# EAGLE design PALM (EAGLE 9.6.2)
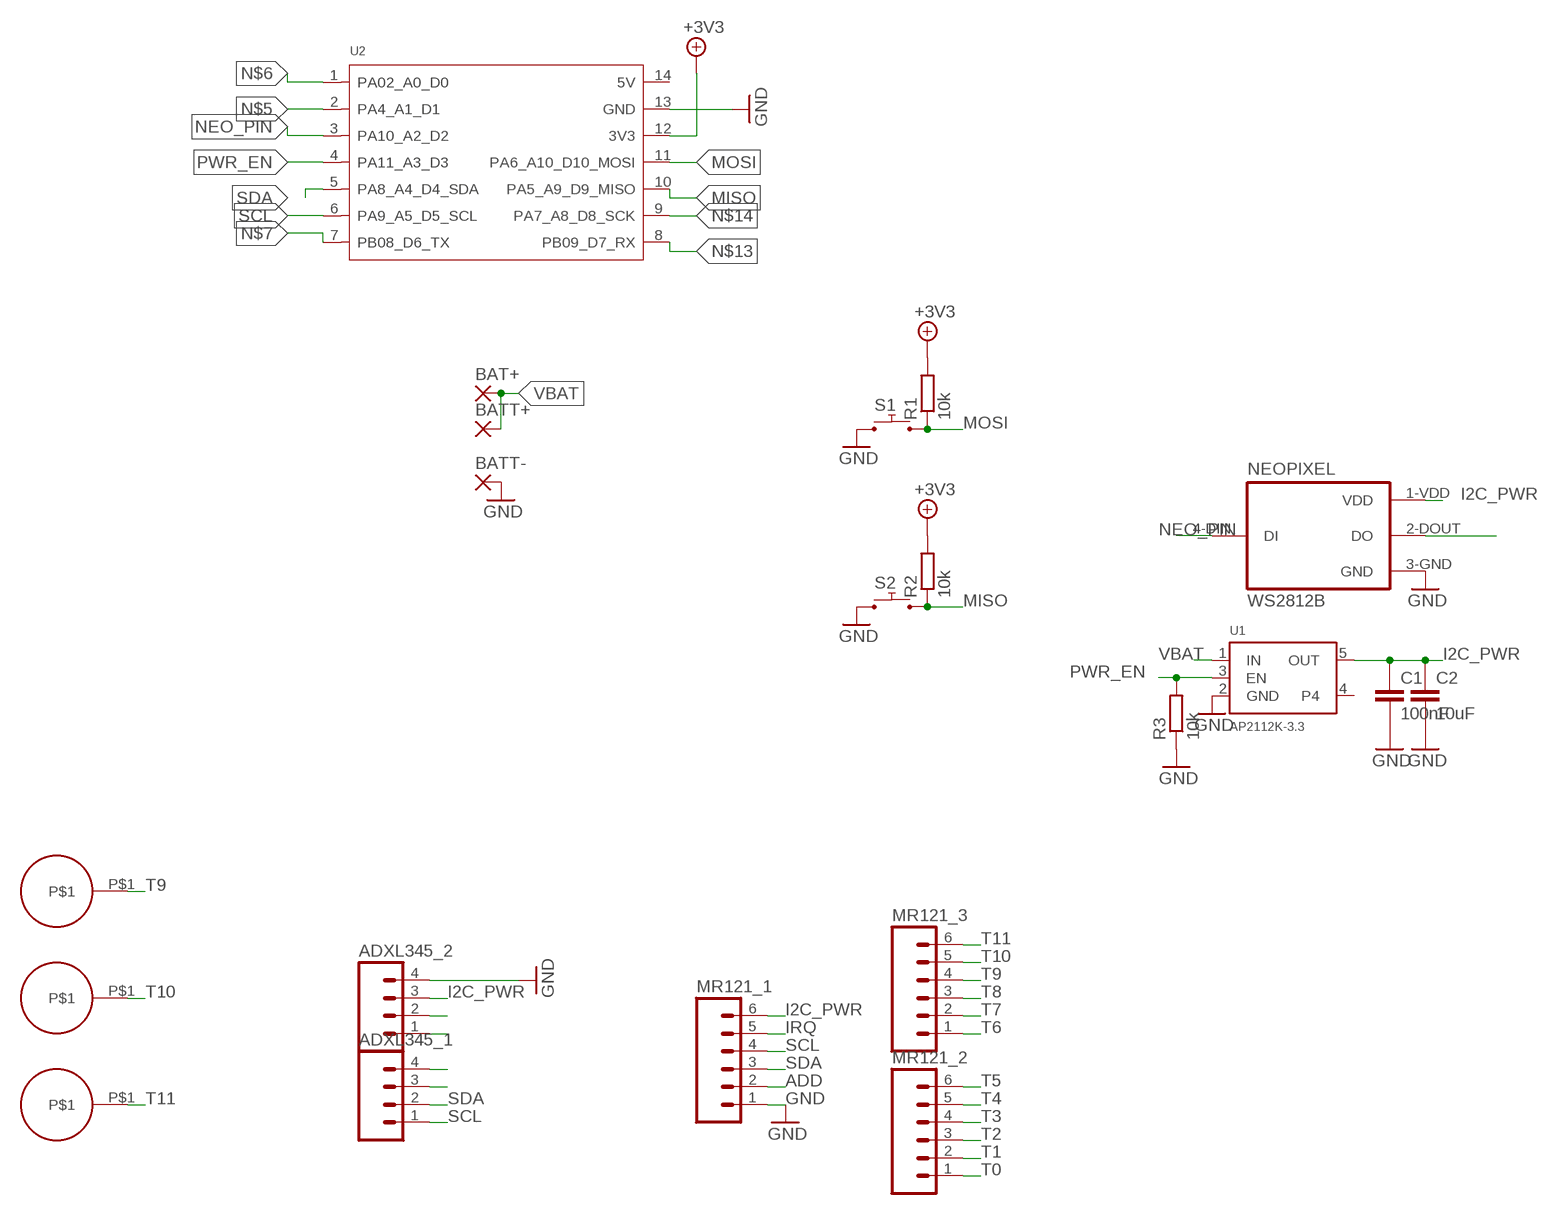
[diagram p0: schematic, sheet 1]

## Parts
ADXL345_1  M04SMD_STRAIGHT_COMBO  [1X04_SMD_STRAIGHT_COMBO]
ADXL345_2  M04SMD_STRAIGHT_COMBO  [1X04_SMD_STRAIGHT_COMBO]
BAT+  SMD2  [SMD1,27-2,54]
BATT+  SMD2  [SMD1,27-2,54]
BATT-  SMD2  [SMD1,27-2,54]
C1  100nF  CAPACITOR0805  [CAPACITOR0805]
C2  10uF  CAPACITOR0805  [CAPACITOR0805]
H2  FEROS_HEATHOLE  [FEROS_HEATHOLE3.2]
H3  FEROS_HEATHOLE  [FEROS_HEATHOLE3.2]
H4  FEROS_HEATHOLE  [FEROS_HEATHOLE3.2]
MR121_1  M06SMD-STRAIGHT-COMBO  [1X06_SMD_STRAIGHT_COMBO]
MR121_2  M06SMD-STRAIGHT-COMBO  [1X06_SMD_STRAIGHT_COMBO]
MR121_3  M06SMD-STRAIGHT-COMBO  [1X06_SMD_STRAIGHT_COMBO]
NEOPIXEL  WS2812B  [WS2812B]
R1  10k  RESISTOR0805  [0805]
R2  10k  RESISTOR0805  [0805]
R3  10k  RESISTOR0805  [0805]
S1  PUSH_MOMENTARY_THT_6X6MM  [TACTILE-PTH]
S2  PUSH_MOMENTARY_THT_6X6MM  [TACTILE-PTH]
U1  AP2112K-3.3  MICROBUILDER_VREG_SOT23-5  [MICROBUILDER_SOT23-5]
U2  MOUDLE-SEEEDUINO-XIAO-ESP32S3-SMD  [MOUDLE14P-SMD-2.54-21X17.8MM]

## Nets
+5V: R1.2 R2.2 U2.12(3V3) ; supply symbol labelled +3V3
ADD: MR121_1.2
GND: ADXL345_2.4 BATT-.1(P) C1.2 C2.2 MR121_1.1 NEOPIXEL.3-GND(GND) R3.1 S1.1 S1.2 S2.1 S2.2 U1.2(GND) U2.13(GND)
I2C_PWR: ADXL345_2.3 C1.1 C2.1 MR121_1.6 NEOPIXEL.1-VDD(VDD) U1.5(OUT)
IRQ: MR121_1.5
MISO: R2.1 S2.3 S2.4 U2.10(PA5_A9_D9_MISO)
MOSI: R1.1 S1.3 S1.4 U2.11(PA6_A10_D10_MOSI)
N$5: U2.2(PA4_A1_D1)
N$6: U2.1(PA02_A0_D0)
N$7: U2.7(PB08_D6_TX)
N$8: ADXL345_1.3
N$9: ADXL345_1.4
N$10: ADXL345_2.1
N$11: ADXL345_2.2
N$12: NEOPIXEL.2-DOUT(DO)
N$13: U2.8(PB09_D7_RX)
N$14: U2.9(PA7_A8_D8_SCK)
NEO_PIN: NEOPIXEL.4-DIN(DI) U2.3(PA10_A2_D2)
PWR_EN: R3.2 U1.3(EN) U2.4(PA11_A3_D3)
SCL: ADXL345_1.1 MR121_1.4 U2.6(PA9_A5_D5_SCL)
SDA: ADXL345_1.2 MR121_1.3 U2.5(PA8_A4_D4_SDA)
T0: MR121_2.1
T1: MR121_2.2
T2: MR121_2.3
T3: MR121_2.4
T4: MR121_2.5
T5: MR121_2.6
T6: MR121_3.1
T7: MR121_3.2
T8: MR121_3.3
T9: H4.P$1 MR121_3.4
T10: H3.P$1 MR121_3.5
T11: H2.P$1 MR121_3.6
VBAT: BAT+.1(P) BATT+.1(P) U1.1(IN)
Unconnected: U1.4 U2.14(5V)

## Library data of the parts
ADXL345_1 ADXL345_2 = BASTL_PINHEADERS:M04: Header 4 Standard 4-pin 0.1" header. Use with straight break away headers (SKU : PRT-00116), right angle break away headers (PRT-00553), swiss pins (PRT-00743), machine pins (PRT-00117), and female headers (PRT-00115). Molex polarized connector foot print use with SKU : PRT-08231 with associated crimp pins and housings. 1MM SMD Version SKU: PRT-10208
BAT+ BATT+ BATT- = wirepad:SMD2: SMD PAD
C1 C2 = BASTL_CAPACITORS:CAPACITOR0805; ODOO: 0.1; SIZEX: 1.2; SIZEY: 2; SIZEZ: 1.2; TYPE: SMT
H2-H4 = BASTL_HOLES:FEROS_HEATHOLE; TYPE: HOLE
MR121_1-MR121_3 = BASTL_PINHEADERS:M06: Header 6 Standard 6-pin 0.1" header. Use with straight break away headers (SKU : PRT-00116), right angle break away headers (PRT-00553), swiss pins (PRT-00743), machine pins (PRT-00117), and female headers (PRT-00115). Molex polarized connector foot print use with SKU : PRT-08094 with associated crimp pins and housings. NOTES ON THE VARIANTS LOCK and LOCK_LONGPADS... This footprint was designed to help hold the alignment of a through-hole component (i.e. 6-pin header) while soldering it into place. You may notice that each hole has been shifted either up or down by 0.005 of an inch from it's more standard position (which is a perfectly straight line). This slight alteration caused the pins (the squares in the middle) to touch the edges of the holes. Because they are alternating, it causes a "brace" to hold the component in place. 0.005 has proven to be the perfect amount of "off-center" position when using our standard breakaway headers. Although looks a little odd when you look at the bare footprint, once you have a header in there, the alteration is very hard to notice. Also,if you push a header all the way into place, it is covered up entirely on the bottom side. This idea of altering the position of holes to aid alignment will be further integrated into the Sparkfun Library for other footprints. It can help hold any component with 3 or more connection pins.
NEOPIXEL = BASTL_LEDS:WS2812: Smart LEDs "NeoPixels" When using THT versions double check the datasheet (APA 106 has a different pinout).
R1-R3 = BASTL_RESISTORS:RESISTOR0805; ASSEMBLED: yes; PRICE: 0.3; SIZEX: 1.2; SIZEY: 2; SIZEZ: 0.5; TYPE: SMT
S1 S2 = BASTL_SWITCHES:PUSH_MOMENTARY: Various NO switches- pushbuttons, reed, etc; TYPE: THT
U1 = Adafruit ESP32-S3 8MB No PSRAM:MICROBUILDER_VREG_SOT23-5: SOT23-5 Fixed Voltage Regulators Part Current Out V Out V In V Dropout θJA (°C/W) TJ (°C) Digikey Part No. ADP121 150mA 3.3V 3.4-5.5V 0.09V @ 150mA -- -- ADP121-AUJZ33R7CT-ND ADP121 150mA 3.0V 3.1-5.5V 0.09V @ 150mA -- -- ADP121-AUJZ30R7CT-ND ADP122 300mA 3.3V 3.4-5.5V 0.085V @ 300mA -- -- ADP122AUJZ-3.3-R7CT-ND ADP1712 300mA 3.3V 3.5-5.5V 0.17V @ 300mA -- -- ADP1712AUJZ-3.3-R7TR-ND AP7311 (Low Cost) 150mA 3.3V 3.5-6V 0.15V @ 150mA -- -- AP7311-33WG-7DICT-ND LD39015M18R 150mA 1.8V 1.9V-5.5V 0.08V @ 100mA -- -- 497-6977-1-ND LP2985A-33DBVR 150mA 3.3V 3.3-16V 0.28V @ 150mA 206 150 296-18479-1-ND MCP1824T-3302E/OT 300mA 3.3V 3.5V-6V 0.2V @ 300mA -- -- MCP1824T-3302E/OTCT-ND MIC5205-2.5YM5 TR 150mA 2.5V 2.7-16V 0.165V @ 150mA -- -- 576-1257-2-ND MIC5205-3.0YM5 TR 150mA 3.0V 3.2V-16V 0.165V @ 150mA -- -- 576-1258-2-ND MIC5205-3.3YM5 TR 150mA 3.3V 3.5V-16V 0.165V @ 150mA -- -- 576-1259-2-ND TPS780330220 150mA 3.3V+2.2V 3.6-5.5V 250mV Max -- -- 296-23332-1-ND TDA3663/N1,135 100mA 3.3V 3.5-45V 0.18V @ 50mA -- -- 568-5343-1-ND Max operating temp can be calculated using θJA, TJ (max junction temperature), and power in watts. Set the "Maximum Ambient Temperature" until it reaches TJ ("Max Junction Temperature"), which is the absolute limit for safe use of the regulator: Heat Sink Temperature Calculator <http://www.daycounter.com/Calculators/Heat-Sink-Temperature-Calculator.phtml> For example, With 12V source into a 3.3V LP2985 and a 30mA load, we are dissipating (12V-3.3V) * 0.03A = 0.261W. With a θJA of 206 °C/W, a TJ of 150°C, and 261mW we can safely use the chip without a heat sink up to 75°C (=147.1°C Junction Temperature).
U2 = Seeed-Studio-XIAO-ESP32S3-footprint-eagle:MOUDLE-SEEEDUINO-XIAO-ESP32S3

## Board
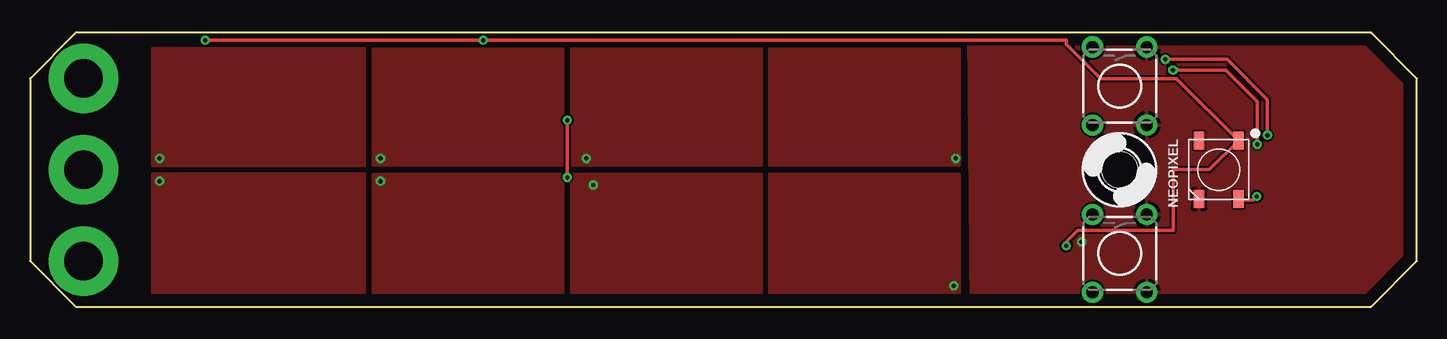
[diagram p1: board, top side]
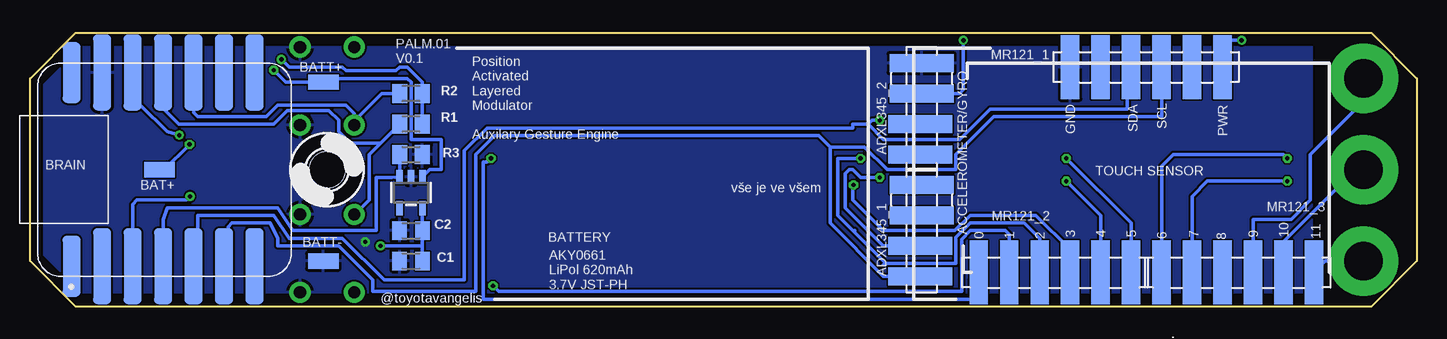
[diagram p2: board, bottom side, seen from below]

Size 115.57 x 22.86 mm. Coordinates in mm from the lower left corner, seen from the top.
Outline: 3.81,0 111.76,0 115.57,3.81 115.57,19.05 111.76,22.86 3.81,22.86 0,19.05 0,3.81 3.81,0
Copper layers (1*16): Top 0.035mm / dielectric 1.5mm / Bottom 0.035mm
Design rules "default": minimum track width 6mil, minimum drill 0.35mm, track to track 6mil, track to pad 6mil, pad to pad 6mil, via to via 6mil, smd to smd 6mil, copper to edge 40mil, drill to drill 6mil, minimum pad ring 10mil, minimum via ring 8mil, stop-mask expansion 4mil, vias tented up to drill 0mil, thermal gap 10mil

### Footprints (pad centres in the part's own frame; a part is rotated, then mirrored left to right if it is on the bottom)
1X04_SMD_STRAIGHT_COMBO = smd 1.524 x 5.334: 1 0,0.127; 2 2.54,0.127; 3 5.08,0; 4 7.62,0
SMD1,27-2,54 = smd 1.27 x 2.54: 1 0,0
CAPACITOR0805 = smd 1.2 x 1.55: 1 -0.95,0; 2 0.95,0
FEROS_HEATHOLE3.2 = drill 3.2 pad 5.8: P$1 0,0
3MM_HOLE = hole 3: 0,0
1X06_SMD_STRAIGHT_COMBO = smd 1.524 x 5.334: 1 0,0; 2 2.54,0; 3 5.08,0; 4 7.62,0; 5 10.16,0; 6 12.7,0
WS2812B = smd 1.5 x 0.9: 1-VDD 2.45,-1.65; 2-DOUT 2.45,1.65; 3-GND -2.45,1.65; 4-DIN -2.45,-1.65
0805 = smd 1.25 x 1.55: 1 -0.95,0; 2 0.95,0
TACTILE-PTH = drill 1.016 pad 1.778: 1 -3.251,2.261; 2 3.251,2.261; 3 -3.251,-2.261; 4 3.251,-2.261
MICROBUILDER_SOT23-5 = smd 0.55 x 1.2: 1 -0.95,-1.3; 2 0,-1.3; 3 0.95,-1.3; 4 0.95,1.3; 5 -0.95,1.3
MOUDLE14P-SMD-2.54-21X17.8MM = smd 5.08 x 1.524: 1 0.835,18.12; 14 17,18.12 | smd 6.35 x 1.524: 2 0.835,15.58; 3 0.835,13.04; 4 0.835,10.5; 5 0.835,7.96; 6 0.835,5.42; 7 0.835,2.88; 8 17,2.88; 9 17,5.42; 10 17,7.96; 11 17,10.5; 12 17,13.04; 13 17,15.58

### Placement (x,y rotation side)
ADXL345_1  41.27,2.54 90 bottom
ADXL345_2  41.27,12.7 90 bottom
BAT+  104.78,11.43 90 bottom
BATT+  91.12,18.73 90 bottom
BATT-  91.12,3.81 90 bottom
C1  83.82,3.81 180 bottom
C2  83.82,6.35 180 bottom
H2  4.45,3.81 270 top
H3  4.45,11.43 270 top
H4  4.45,19.05 270 top
H9  HOLE_3MM  [3MM_HOLE]  90.81,11.43 0 top
MR121_1  28.89,20 0 bottom
MR121_2  36.51,2.86 0 bottom
MR121_3  21.27,2.86 0 bottom
NEOPIXEL  99.06,11.43 90 top
R1  83.82,15.24 0 bottom
R2  83.82,17.78 0 bottom
R3  83.82,12.7 180 bottom
S1  90.81,4.45 270 top
S2  90.81,18.41 270 top
U1  83.82,9.53 180 bottom
U2  93.98,2.54 90 bottom

### Tracks (layer width: path | path; a pad name or v marks a point on that pad's centre or on a via)
+5V  (via drill 0.35)
  Top 0.305: v103.12,14.31 103.12,17.27 99.76,20.64 v94.61,20.64
  Bottom 0.305: R1.2 R2.2 82.87,18.73 84.14,20 84.77,20 85.09,19.68 89.22,19.68 89.53,20 93.98,20 v94.61,20.64 | U2.12 107.02,16.85 107,16.83 106.36,16.83 104.14,14.61 v103.12,14.31
GND  (via drill 0.35)
  other vias: 87.63,5.4
  pour Bottom: 8.74,0 111.76,0 115.57,3.81 115.57,19.05 111.76,22.86 8.74,22.86
  pour Top: 111.76,0 115.57,3.81 115.57,19.05 111.76,22.86 78.23,22.86 78.42,0
I2C_PWR  (via drill 0.35)
  Top 0.305: v86.36,5.08 86.36,5.4 87.31,6.35 95.25,6.35 95.25,11.43 98.26,11.43 NEOPIXEL.1-VDD 95.54,19.05 89.22,19.05 86.36,21.91 86.36,22.23 v37.78,22.23 v14.61,22.23
  Bottom 0.305: C1.1 C2.1 | C2.1 U1.5 | C2.1 82.87,5.08 v86.36,5.08 | ADXL345_2.3 38.1,17.78 37.78,18.1 v37.78,22.23 | v14.61,22.23 16.19,22.23 MR121_1.6
MISO
  Bottom 0.305: R2.1 86.25,17.78 88.54,15.48 S2.4 88.54,16.12 89.26,16.83 94.93,16.83 95.89,15.88 101.6,15.88 101.94,16.21 U2.10
MOSI
  Bottom 0.305: R1.1 86.36,13.65 | 86.36,13.65 87.31,12.7 87.31,8.93 S1.3 | U2.11 104.48,16.53 103.19,15.24 95.25,15.24 94.12,16.37 90.67,16.37 89.85,15.56 89.85,14.61 88.9,13.65 86.36,13.65
NEO_PIN  (via drill 0.35)
  Top 0.305: v102.23,9.21 101.92,8.89 100.8,8.89 NEOPIXEL.4-DIN
  Bottom 0.305: U2.3 107.02,8.55 106.68,8.89 102.55,8.89 v102.23,9.21
PWR_EN
  Bottom 0.305: R3.2 U1.3 85.44,10.79 86.73,10.79 86.73,6.35 93.66,6.35 94.93,8.26 104.14,8.26 104.48,7.28 U2.4
SCL
  Bottom 0.305: U2.6 99.06,3.71 99.06,6.67 98.74,6.99 95.57,6.99 94.93,5.71 94.93,5.08 89.85,5.08 87,2.22 87,1.27 78.42,1.27 78.42,12.7 76.83,14.29 49.85,14.29 48.9,13.34 | 48.9,13.34 48.9,6.99 44.45,2.54 ADXL345_1.1 | MR121_1.4 21.27,15.88 35.24,15.88 38.42,12.7 38.42,11.43 44.13,11.43 46.04,13.34 48.9,13.34
SDA  (via drill 0.35)
  Top 0.305: v44.77,15.56 v44.77,10.79
  Bottom 0.305: U2.5 101.6,3.71 101.6,7.62 95.25,7.62 93.98,5.71 89.53,5.71 86.04,2.22 79.38,2.22 79.38,13.02 77.47,14.92 46.99,14.92 46.99,15.24 45.72,15.24 | ADXL345_1.2 39.69,5.08 | MR121_1.3 24.13,19.68 24.13,16.51 35.56,16.51 38.1,13.97 44.45,13.97 45.72,15.24 | ADXL345_1.2 39.37,5.08 | ADXL345_1.2 44.45,5.08 47.62,8.26 47.62,11.11 47.31,11.43 46.99,11.43 46.35,10.79 v44.77,10.79 | 45.72,15.24 45.4,15.56 v44.77,15.56
T0  (via drill 0.35)
  Bottom 0.305: MR121_2.1 37.15,2.22 37.15,0.64 77.79,0.64 77.79,12.06 77.47,12.06 v77.15,12.38
  pour Top: 77.47,21.59 77.47,11.75 61.59,11.75 61.59,21.59
T1  (via drill 0.35)
  Bottom 0.305: MR121_2.2 33.97,6.03 34.29,6.35 37.2,6.35 37.92,5.62 37.92,1.27 76.5,1.27 v76.99,1.75
  pour Top: 77.47,11.11 77.47,0.95 61.59,0.95 61.59,11.11
T2  (via drill 0.35)
  Bottom 0.305: MR121_2.3 31.43,5.71 32.7,6.99 37.21,6.99 38.42,5.78 38.42,3.61 44.2,3.61 44.22,3.58 | 44.22,3.58 44.31,3.49 44.45,3.49 | 44.22,3.58 46.85,6.21 | 46.85,6.21 46.85,6.35 | 46.85,6.21 48.26,7.62 48.26,12.38 v46.35,12.38
  pour Top: 60.96,21.59 60.96,11.75 45.09,11.75 45.09,21.59
T3  (via drill 0.35)
  Bottom 0.305: MR121_2.4 28.89,4.76 31.75,7.62 37.22,7.62 38.49,6.35 44.45,6.35 46.99,8.89 46.99,10.16 v46.94,10.16
  pour Top: 60.96,11.11 60.96,0.95 45.09,0.95 45.09,11.11
T4  (via drill 0.35)
  Bottom 0.305: MR121_2.5 26.35,7.62 v29.21,10.48
  pour Top: 44.45,11.11 44.45,0.95 28.57,0.95 28.57,11.11
T5  (via drill 0.35)
  Bottom 0.305: MR121_2.6 23.81,6.99 v29.21,12.38
  pour Top: 44.45,21.59 44.45,11.75 28.57,11.75 28.57,21.59
T6  (via drill 0.35)
  Bottom 0.305: MR121_3.1 21.27,11.75 20.32,12.7 11.11,12.7 v10.79,12.38
  pour Top: 10.16,21.59 10.16,11.75 27.94,11.75 27.94,21.59
T7  (via drill 0.35)
  Bottom 0.305: MR121_3.2 18.73,9.21 17.46,10.48 v10.79,10.48
  pour Top: 10.16,11.11 10.16,0.95 27.94,0.95 27.94,11.11
T9
  Bottom 0.305: MR121_3.4 13.65,7.3 10.48,7.3 8.89,8.89 8.89,12.7 5.08,16.51 4.45,16.51 H4.P$1
T10
  Bottom 0.305: MR121_3.5 11.11,5.4 5.08,11.43 H3.P$1
T11
  Bottom 0.305: H2.P$1 7.62,3.81 MR121_3.6
VBAT  (via drill 0.35)
  Top 0.305: v95.25,19.73 99.65,19.73 102.28,17.1 v102.28,13.55
  Bottom 0.305: U1.1 82.27,11.43 81.28,11.43 81.28,13.97 83.82,13.97 83.82,18.73 84.14,19.05 90.81,19.05 BATT+.1 94.25,18.73 v95.25,19.73 | BAT+.1 104.39,11.43 v102.28,13.55

### Text on the board
bPlace: PALM.01 / V0.1 | PWR | SCL | SDA | GND | Position / Activated / Layered / Modulator / / Auxilary Gesture Engine | TOUCH SENSOR | BRAIN | vše je ve všem | 11 | 10 | 9 | 8 | 7 | 6 | 5 | 4 | 3 | 2 | 1 | 0 | ACCELEROMETER/GYRO | BATTERY | AKY0661 / LiPol 620mAh / 3.7V JST-PH | @toyotavangelis